# Altium schematic sheet Shift Registers.SchDoc
size A4; SheetNumber: 4; SheetTotal: 4
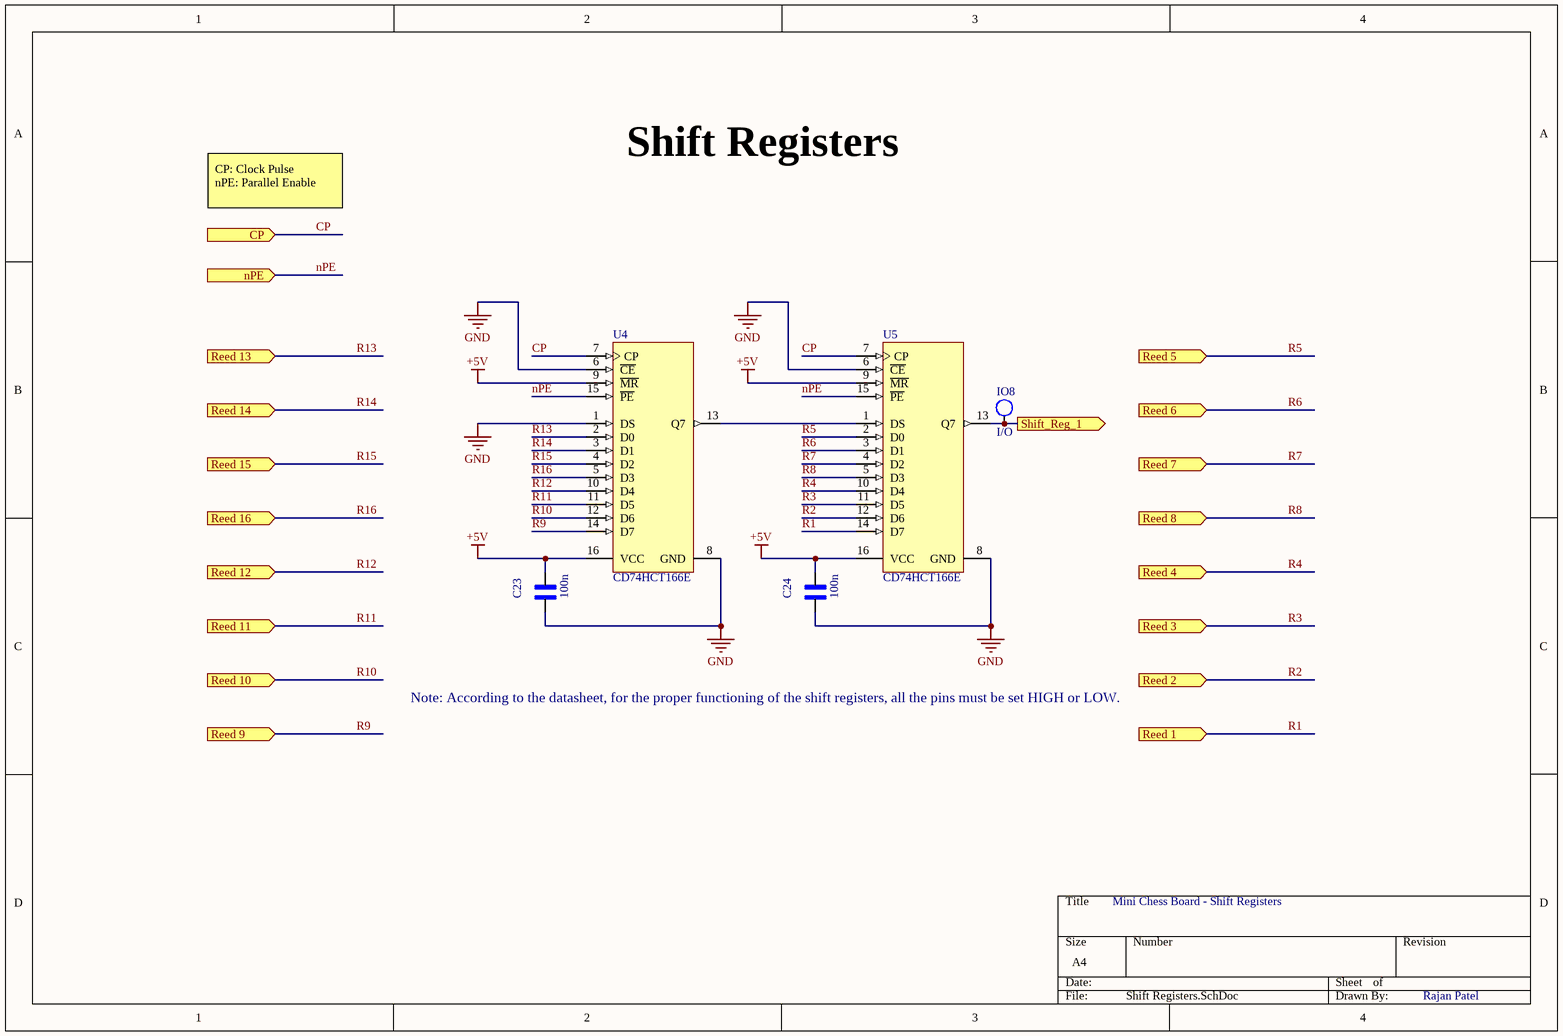
[diagram p0: Shift Registers.SchDoc]

## Parts
C23  100n  [CAP 0805]
C24  100n  [CAP 0805]
IO8  I/O  [I/O]
U4  CD74HCT166E  [N0016A]
U5  CD74HCT166E  [N0016A]

## Ports
CP (in, see MCU and Power Man[2C]), nPE (in, see MCU and Power Man[2C]), Reed 1 (in, see Reed Switches[1A]), Reed 2 (in, see Reed Switches[2A]), Reed 3 (in, see Reed Switches[3A]), Reed 4 (in, see Reed Switches[3A]), Reed 5 (in, see Reed Switches[1B]), Reed 6 (in, see Reed Switches[2B]), Reed 7 (in, see Reed Switches[3B]), Reed 8 (in, see Reed Switches[3B]), Reed 9 (in, see Reed Switches[1C]), Reed 10 (in, see Reed Switches[2C]), Reed 11 (in, see Reed Switches[3C]), Reed 12 (in, see Reed Switches[3C]), Reed 13 (in, see Reed Switches[1D]), Reed 14 (in, see Reed Switches[2D]), Reed 15 (in, see Reed Switches[3D]), Reed 16 (in, see Reed Switches[3D]), Shift_Reg_1 (out, see MCU and Power Man[2C])

## Nets
+5V: C23.2 C24.2 U4.9(~{MR}) U4.16(VCC) U5.9(~{MR}) U5.16(VCC)
GND: C23.1 C24.1 U4.1(DS) U4.6(~{CE}) U4.8(GND) U5.6(~{CE}) U5.8(GND)
CP: U4.7(CP) U5.7(CP) ; port CP
nPE: U4.15(~{PE}) U5.15(~{PE}) ; port nPE
R1: U5.14(D7) ; port Reed 1
R2: U5.12(D6) ; port Reed 2
R3: U5.11(D5) ; port Reed 3
R4: U5.10(D4) ; port Reed 4
R5: U5.2(D0) ; port Reed 5
R6: U5.3(D1) ; port Reed 6
R7: U5.4(D2) ; port Reed 7
R8: U5.5(D3) ; port Reed 8
R9: U4.14(D7) ; port Reed 9
R10: U4.12(D6) ; port Reed 10
R11: U4.11(D5) ; port Reed 11
R12: U4.10(D4) ; port Reed 12
R13: U4.2(D0) ; port Reed 13
R14: U4.3(D1) ; port Reed 14
R15: U4.4(D2) ; port Reed 15
R16: U4.5(D3) ; port Reed 16
Shift_Reg_1: IO8.1 U5.13(Q7) ; port Shift_Reg_1
NetU4_13: U4.13(Q7) U5.1(DS)

## Notes on the sheet
- Shift Registers
- CP: Clock Pulse
  nPE: Parallel Enable
- Note: According to the datasheet, for the proper functioning of the shift registers, all the pins must be set HIGH or LOW.
- Mini Chess Board - Shift Registers
- Rajan Patel

## Library data of the parts
C23 C24 = CAP 0805: SnapEDA_Link: https://www.snapeda.com/parts/C2012X8R1H104K125AA/TDK/view-part/?ref=snap; Check_prices: https://www.snapeda.com/parts/C2012X8R1H104K125AA/TDK/view-part/?ref=eda; Value: *
U4 U5 = CMP-0807-00166-3: High Speed CMOS Logic 8-Bit Parallel-In/Serial-Out Shift Register, N0016A, TUBE; Manufacturer: Texas Instruments; Voltage(Nom)(V): 5; Bits: 8; Output Drive (IOL/IOH)(Max)(mA): 4/-4; F @ Nom Voltage(Max)(Mhz): 25; VCC(Max)(V): 5.5; 3-State Output: No; VCC(Min)(V): 4.5; tpd @ Nom Voltage(Max)(ns): 50; Technology Family: HCT; Input Type: TTL; ICC @ Nom Voltage(Max)(mA): 0.08; Rating: Catalog; Operating Temperature Range(C): -55 to 125; PackageVersion: http://www.ti.com/lit/ml/mpdi002c/mpdi002c.pdf; DatasheetVersion: SCHS157C; Generic Part Number: CD74HCT166; PackageReference: N0016A; Code_JEDEC: MS-001; Output Type: CMOS